# Altium schematic sheet Voltage_Measurment.SchDoc
size A; SheetNumber: 7; SheetTotal: 12
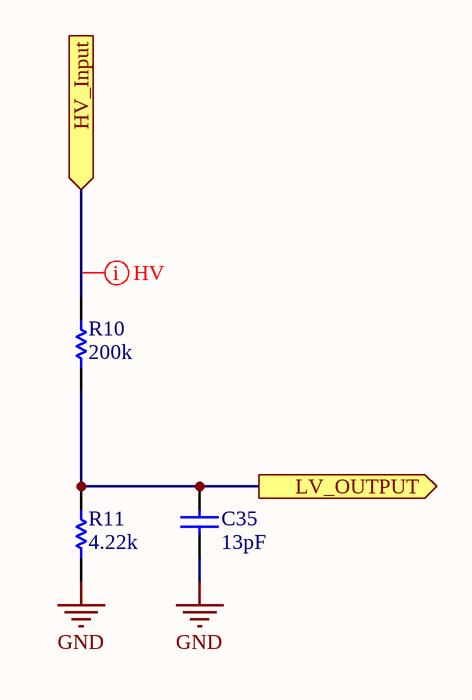
[diagram p0: Voltage_Measurment.SchDoc]

## Parts
C35  value 13pF  [0603_CAPACITOR]  (hidden comment: Capacitor 13pF 0603 5% 50V)
R10  value 200k  [1206_RESISTOR]  (hidden comment: Resistor 200K 1206 1% 1/4W)
R11  value 4.22k  [0603_RESISTOR]  (hidden comment: Resistor 4.22k 0603 0.1W 1%)

## Ports
HV_Input (in, see MPPT[2B]), LV_OUTPUT (out, see MPPT[2C])

## Nets
GND: C35.1 R11.1
HV_Input: R10.2 ; port HV_Input
LV_OUTPUT: C35.2 R10.1 R11.2 ; port LV_OUTPUT

## Layout directives
net class HV: HV_Input

## Library data of the parts
C35 = CMP-001-00121-1: Ceramic Capacitor, Multilayer, Ceramic, 50V, 5% +Tol, 5% -Tol, C0G, 30ppm/Cel TC, 0.000013uF, Surface Mount, 0603; Tolerance: 5%; Min Operating Temperature: -55°C; Max Operating Temperature: 125°C; Mounting Technology: SMD; Case/Package: 0603; Voltage Rating: 50V; Capacitor Type: Ceramic
R10 = Resistor     0007-1: Power: 250mW; Max Operating Temperature: 155°C; Tolerance: 1%; Min Operating Temperature: -55°C; Mounting Technology: SMD; RoHS Compliant: Yes; Case/Package: 1206
R11 = Resistor     0006-1: Fixed Resistor, Metal Glaze/thick Film, 0.1W, 4220ohm, 75V, 1% +/-Tol, 100ppm/Cel, Surface Mount, 0603; Power: 100mW; Case/Package: 0603; Tolerance: 1%; RoHS Compliant: Yes; Mounting Technology: SMD; Min Operating Temperature: -55°C; Max Operating Temperature: 155°C